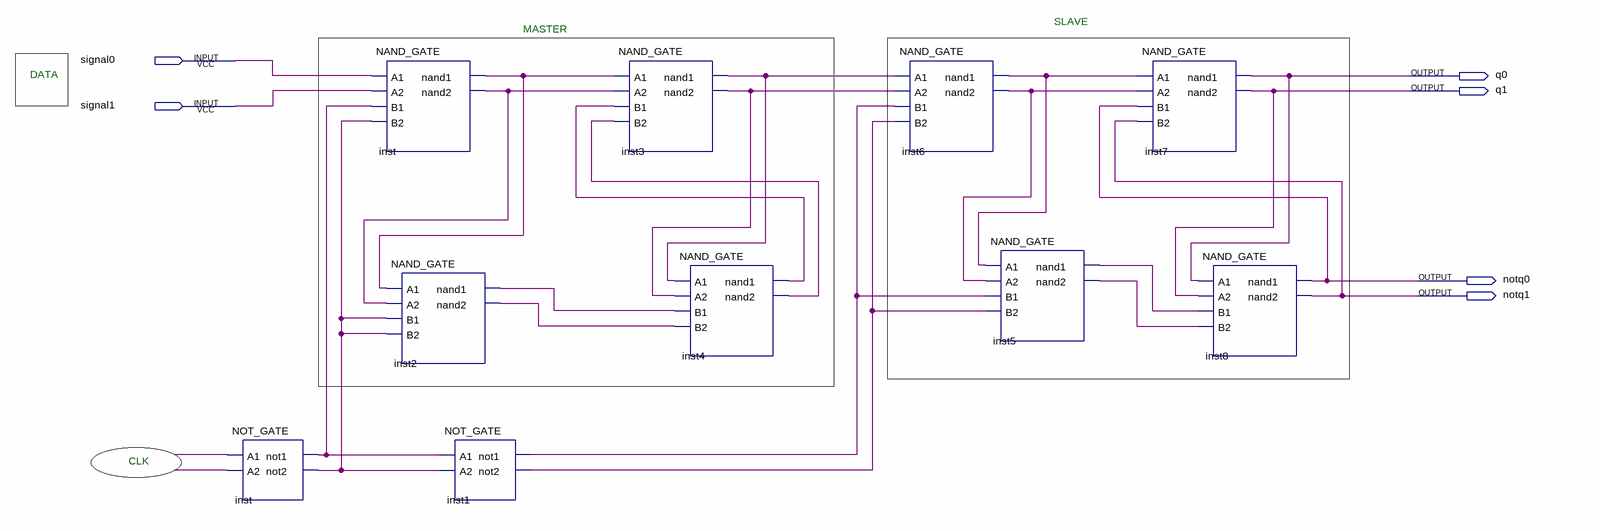
[diagram p0: schematic sheet]
// Quartus schematic flip_flap_flop.bdf as structural Verilog: 10 symbols, 6 pins
module flip_flap_flop (
  input  signal0,
  input  signal1,
  output q0,
  output q1,
  output notq0,
  output notq1
);

  wire inst1_not1, inst1_not2, inst2_nand1, inst2_nand2, inst3_nand1, inst3_nand2, inst4_nand1, inst4_nand2,
       inst5_nand1, inst5_nand2, inst6_nand1, inst6_nand2, inst_nand1, inst_nand2, inst_not1, inst_not2,
       undriven, undriven_2;

  NOT_GATE inst (.A1(undriven), .A2(undriven_2), .not1(inst_not1), .not2(inst_not2));
  NAND_GATE inst_dup2 (
    .A1(signal0), .A2(signal1), .B1(inst_not1), .B2(inst_not2), .nand1(inst_nand1), .nand2(inst_nand2));
  NAND_GATE inst2 (
    .A1(inst_nand1), .A2(inst_nand2), .B1(inst_not2), .B2(inst_not2), .nand1(inst2_nand1), .nand2(inst2_nand2));
  NOT_GATE inst1 (.A1(inst_not1), .A2(inst_not2), .not1(inst1_not1), .not2(inst1_not2));
  NAND_GATE inst3 (
    .A1(inst_nand1), .A2(inst_nand2), .B1(inst4_nand1), .B2(inst4_nand2), .nand1(inst3_nand1),
    .nand2(inst3_nand2));
  NAND_GATE inst4 (
    .A1(inst3_nand1), .A2(inst3_nand2), .B1(inst2_nand1), .B2(inst2_nand2), .nand1(inst4_nand1),
    .nand2(inst4_nand2));
  NAND_GATE inst6 (
    .A1(inst3_nand1), .A2(inst3_nand2), .B1(inst1_not1), .B2(inst1_not2), .nand1(inst6_nand1),
    .nand2(inst6_nand2));
  NAND_GATE inst5 (
    .A1(inst6_nand1), .A2(inst6_nand2), .B1(inst1_not1), .B2(inst1_not2), .nand1(inst5_nand1),
    .nand2(inst5_nand2));
  NAND_GATE inst7 (.A1(inst6_nand1), .A2(inst6_nand2), .B1(notq0), .B2(notq1), .nand1(q0), .nand2(q1));
  NAND_GATE inst8 (.A1(q0), .A2(q1), .B1(inst5_nand1), .B2(inst5_nand2), .nand1(notq0), .nand2(notq1));

  // Notes on the sheet:
  //   SLAVE
  //   MASTER
  //   DATA
  //   CLK
endmodule
